# EAGLE design board (EAGLE 6.5.0)
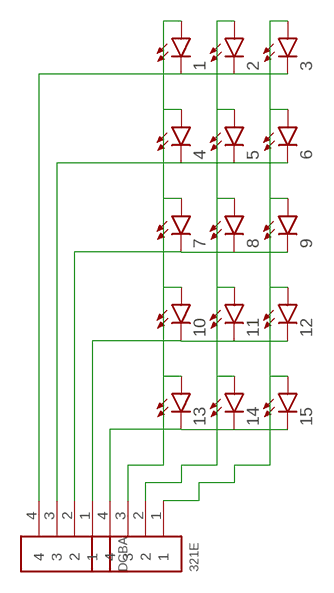
[diagram p0: schematic, sheet 1]

## Parts
1  LED3MM  [LED3MM]
2  LED3MM  [LED3MM]
3  LED3MM  [LED3MM]
4  LED3MM  [LED3MM]
5  LED3MM  [LED3MM]
6  LED3MM  [LED3MM]
7  LED3MM  [LED3MM]
8  LED3MM  [LED3MM]
9  LED3MM  [LED3MM]
10  LED3MM  [LED3MM]
11  LED3MM  [LED3MM]
12  LED3MM  [LED3MM]
13  LED3MM  [LED3MM]
14  LED3MM  [LED3MM]
15  LED3MM  [LED3MM]
321E  1X4-BIG  [1X04-BIG]
DCBA  1X4-BIG  [1X04-BIG]

## Nets
1: 2.A 5.A 8.A 11.A 14.A 321E.2
N$1: 1.K(C) 2.K(C) 3.K(C) DCBA.4
N$2: 4.K(C) 5.K(C) 6.K(C) DCBA.3
N$3: 7.K(C) 8.K(C) 9.K(C) DCBA.2
N$4: 10.K(C) 11.K(C) 12.K(C) DCBA.1
N$5: 13.K(C) 14.K(C) 15.K(C) 321E.4
N$6: 1.A 4.A 7.A 10.A 13.A 321E.3
N$8: 3.A 6.A 9.A 12.A 15.A 321E.1

## Library data of the parts
1-15 = SparkFun-LED:LED: LEDs Standard schematic elements and footprints for 5mm, 3mm, 1206, and 0603 sized LEDs. 5mm - Spark Fun Electronics SKU : COM-00529 (and others)
321E DCBA = adafruit:1X4: 4-pin connector

## Board
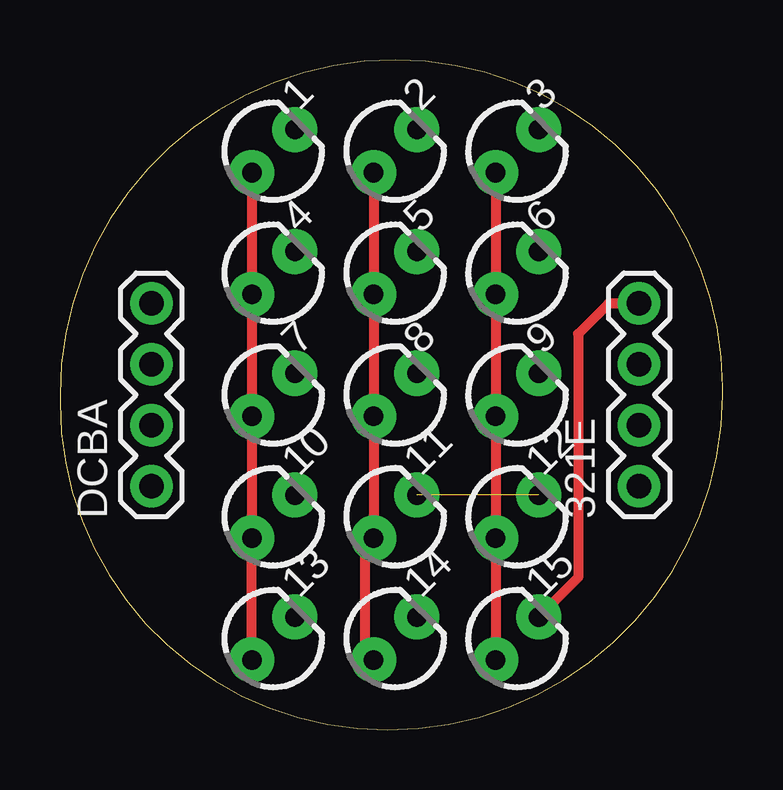
[diagram p1: board, top side]
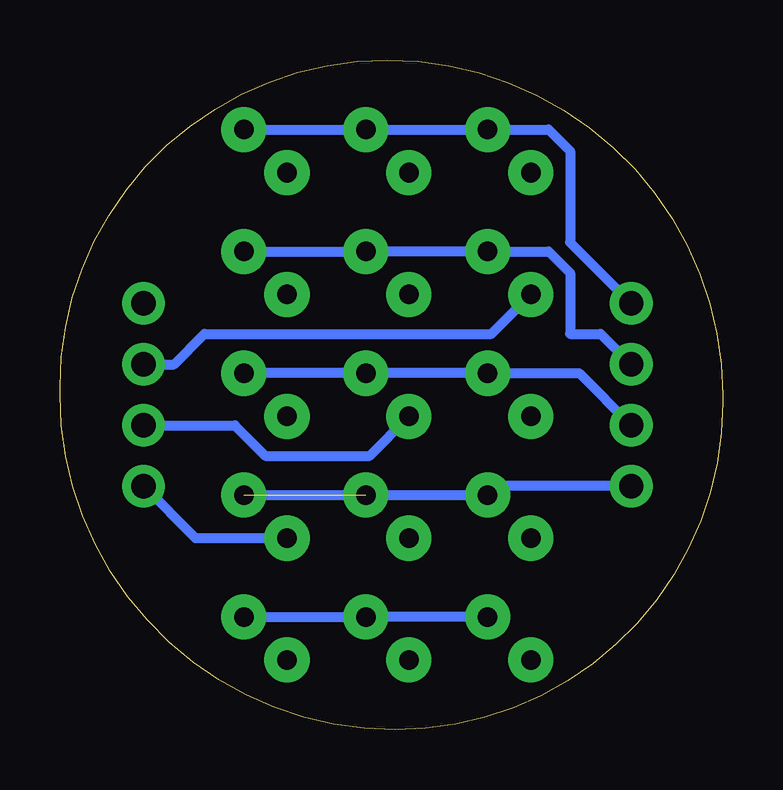
[diagram p2: board, bottom side, seen from below]

Size 27.61 x 27.93 mm. Coordinates in mm from the lower left corner, seen from the top.
Outline: 0,13.96 0,13.64 arc90 13.64,0 arc90 27.61,13.97 27.61,14.29 arc90 13.97,27.93 arc90 0,13.96
Copper layers (1*16): Top 0.035mm / dielectric 1.5mm / Bottom 0.035mm
Design rules "default": minimum track width 10mil, minimum drill 24mil, track to track 8mil, track to pad 8mil, pad to pad 8mil, via to via 8mil, smd to smd 8mil, copper to edge 40mil, drill to drill 8mil, minimum pad ring 10mil, minimum via ring 8mil, stop-mask expansion 4mil, vias tented up to drill 0mil, thermal gap 10mil

### Footprints (pad centres in the part's own frame; a part is rotated, then mirrored left to right if it is on the bottom)
LED3MM = drill 0.813 pad 1.88: A -1.27,0; K 1.27,0
1X04-BIG = drill 1.016 pad 1.778: 1 0,0; 2 2.54,0; 3 5.08,0; 4 7.62,0

### Placement (x,y rotation side)
1  8.89,24.13 45 top
2  13.97,24.13 45 top
3  19.05,24.13 45 top
4  8.89,19.05 45 top
5  13.97,19.05 45 top
6  19.05,19.05 45 top
7  8.89,13.97 45 top
8  13.97,13.97 45 top
9  19.05,13.97 45 top
10  8.89,8.89 45 top
11  13.97,8.89 45 top
12  19.05,8.89 45 top
13  8.89,3.81 45 top
14  13.97,3.81 45 top
15  19.05,3.81 45 top
321E  24.13,10.16 90 top
DCBA  3.81,10.16 90 top

### Tracks (layer width: path | path; a pad name or v marks a point on that pad's centre or on a via)
1
  Top 0.406: 2.A 5.A 8.A 11.A 12.7,7.62 12.7,3.28 14.A
  Bottom 0.406: 321E.2 20.32,12.7 19.05,11.43 14.71,11.43 8.A
N$1
  Bottom 0.406: 3.K 2.K 1.K 7.25,25.03 6.35,24.13 6.35,20.32 DCBA.4
N$2
  Bottom 0.406: 6.K 5.K 4.K 7.25,19.95 6.35,19.05 6.35,16.51 5.08,16.51 DCBA.3
N$3
  Bottom 0.406: 9.K 8.K 7.K 5.98,14.87 DCBA.2
N$4  (1 unrouted)
  Bottom 0.406: 12.K 10.K arc90 9.42,10.16 DCBA.1
N$5
  Top 0.406: 321E.4 22.86,17.78 21.59,16.51 21.59,6.35 15.K
  Bottom 0.406: 13.K 14.K 15.K
N$6
  Top 0.406: 1.A 4.A 7.A 10.A 13.A
  Bottom 0.406: 321E.3 22.86,15.24 21.59,16.51 9.63,16.51 4.A
N$8
  Top 0.406: 3.A 6.A 9.A 12.A 15.A
  Bottom 0.406: 12.A 21.96,7.99 321E.1